# EAGLE design Sorter (EAGLE 9.5.1)
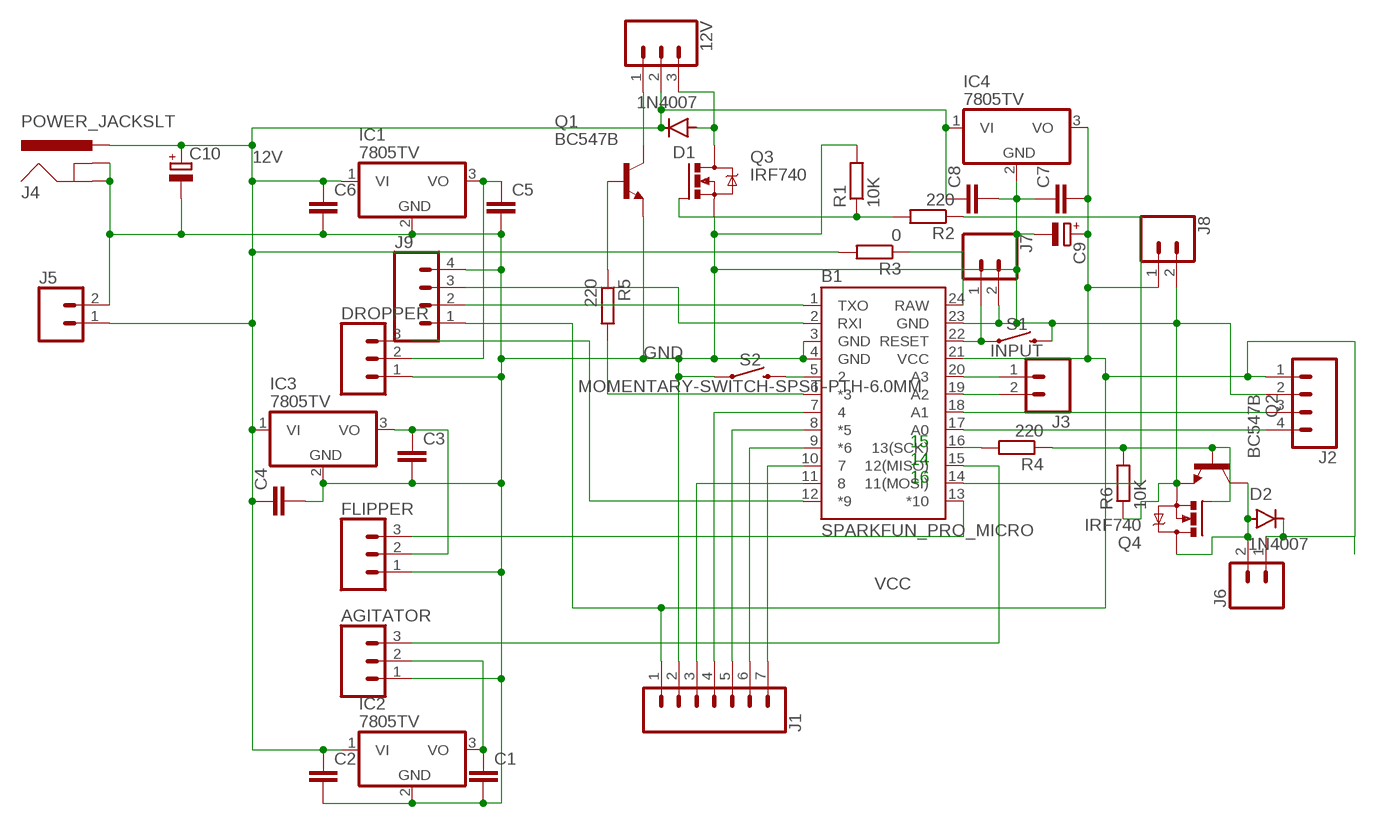
[diagram p0: schematic, sheet 1]

## Parts
12V  CONN_03LONGPADS  [1X03_LONGPADS]
AGITATOR  CONN_03LONGPADS  [1X03_LONGPADS]
B1  SPARKFUN_PRO_MICRO  [SPARKFUN_PRO_MICRO]
C1  C2.5/2  [C2.5-2]
C2  C2.5/2  [C2.5-2]
C3  C2.5/2  [C2.5-2]
C4  C2.5/2  [C2.5-2]
C5  C2.5/2  [C2.5-2]
C6  C2.5/2  [C2.5-2]
C7  C2.5/2  [C2.5-2]
C8  C2.5/2  [C2.5-2]
C9  CPOL-EUE2.5-5  [E2,5-5]
C10  CPOL-EUE2.5-5  [E2,5-5]
D1  1N4007  [DO-41]
D2  1N4007  [DO-41]
DROPPER  CONN_03LONGPADS  [1X03_LONGPADS]
FLIPPER  CONN_03LONGPADS  [1X03_LONGPADS]
IC1  7805TV  [TO220V]
IC2  7805TV  [TO220V]
IC3  7805TV  [TO220V]
IC4  7805TV  [TO220V]
J1  CONN_07LONGPADS  [1X07_LONGPADS]
J2  CONN_04LONGPADS  [1X04_LONGPADS]
J3  CONN_02  [1X02]
J4  POWER_JACKSLT  [POWER_JACK_SLOT]
J5  CONN_023.5MM  [SCREWTERMINAL-3.5MM-2]
J6  CONN_02PTH3  [1X02_LONGPADS]
J7  CONN_02PTH3  [1X02_LONGPADS]
J8  CONN_02  [1X02]
J9  CONN_04  [1X04]
Q1  BC547B  [TO92]
Q2  BC547B  [TO92]
Q3  IRF740  [TO220BV]
Q4  IRF740  [TO220BV]
R1  10K  R-EU_0204/7  [0204/7]
R2  220  R-EU_0204/7  [0204/7]
R3  0  R-EU_0204/7  [0204/7]
R4  220  R-EU_0204/7  [0204/7]
R5  220  R-EU_0204/7  [0204/7]
R6  10K  R-EU_0204/7  [0204/7]
S1  INPUT  MOMENTARY-SWITCH-SPST-PTH-6.0MM  [TACTILE_SWITCH_PTH_6.0MM]
S2  MOMENTARY-SWITCH-SPST-PTH-6.0MM  [TACTILE_SWITCH_PTH_6.0MM]

## Nets
12V: 12V.2 C2.1 C4.1 C6.1 C8.1 C10.+ D1.C IC1.1(VI) IC2.1(VI) IC3.1(VI) IC4.1(VI) J4.PWR J5.1 R3.2
GND: AGITATOR.1 B1.3(GND) B1.4(GND) B1.23(GND) C1.2 C2.2 C3.2 C4.2 C5.2 C6.2 C7.1 C8.2 C9.- C10.- DROPPER.1 FLIPPER.1 IC1.2(GND) IC2.2(GND) IC3.2(GND) IC4.2(GND) J1.2 J2.2 J4.GND@1(GNDBREAK) J4.GND@2(GND) J5.2 J7.2 J8.2 J9.4 Q1.1(E) Q2.1(E) Q3.S Q4.S R1.2 R6.1 S1.3 S2.1
N$1: AGITATOR.2 C1.1 IC2.3(VO)
N$2: C5.1 DROPPER.2 IC1.3(VO)
N$3: C3.1 FLIPPER.2 IC3.3(VO)
N$4: B1.12(*9) DROPPER.3
N$5: B1.13(*10) FLIPPER.3
N$6: AGITATOR.3 B1.15(12(MISO))
N$7: 12V.1 Q1.3(C)
N$8: B1.6(*3) R5.2
N$9: B1.14(11(MOSI)) R2.1
N$10: 12V.3 D1.A Q3.D
N$11: Q3.G R1.1 R2.2
N$12: B1.10 J1.7
N$13: B1.9(*6) J1.6
N$14: B1.8(*5) J1.5
N$15: B1.7 J1.4
N$16: B1.11 J1.3
N$17: B1.2(RXI) J9.3
N$18: B1.24(RAW) R3.1
N$19: B1.19(A2) J3.2
N$20: B1.22(RESET) J7.1 S1.1
N$21: B1.5 S2.3
N$22: B1.1(TXO) J9.2
N$23: B1.18(A1) J2.3
N$24: B1.17(A0) J2.4
N$25: B1.16(13(SCK)) R4.2
N$26: Q2.2(B) Q4.G R4.1 R6.2
N$27: Q1.2(B) R5.1
N$28: D2.A J6.2 Q2.3(C) Q4.D
N$29: B1.20(A3) J3.1
VCC: B1.21(VCC) C7.2 C9.+ D2.C IC4.3(VO) J1.1 J2.1 J6.1 J8.1 J9.1

## Notes on the sheet
- 15
- 14
- 16

## Library data of the parts
12V AGITATOR DROPPER FLIPPER = SparkFun-Connectors:CONN_03: Multi connection point. Often used as Generic Header-pin footprint for 0.1 inch spaced/style header connections On any of the 0.1 inch spaced packages, you can populate with these: Break Away Headers - Straight <https://www.sparkfun.com/products/116> (PRT-00116) Break Away Male Headers - Right Angle <https://www.sparkfun.com/products/553> (PRT-00553) Female Headers <https://www.sparkfun.com/products/115> (PRT-00115) Break Away Headers - Machine Pin <https://www.sparkfun.com/products/117> (PRT-00117) Break Away Female Headers - Swiss Machine Pin <https://www.sparkfun.com/products/743> (PRT-00743) Stackable Header - 3 Pin (Female, 0.1") <https://www.sparkfun.com/products/13875> (PRT-13875) For SCREWTERMINALS and SPRING TERMINALS visit here: Screw Terimnals on SparkFun.com <https://www.sparkfun.com/search/results?term=Screw+Terminals> (5mm/3.5mm/2.54mm spacing) This device is also useful as a general connection point to wire up your design to another part of your project. Our various solder wires solder well into these plated through hole pads. Hook-Up Wire - Assortment (Stranded, 22 AWG) <https://www.sparkfun.com/products/11375> (PRT-11375) Hook-Up Wire - Assortment (Solid Core, 22 AWG) <https://www.sparkfun.com/products/11367> (PRT-11367) View the entire wire category on our website here <https://www.sparkfun.com/categories/141> Special notes: Molex polarized connector foot print use with SKU : PRT-08232 with associated crimp pins and housings.
B1 = SparkFun-Boards:SPARKFUN_PRO_MICRO: SparkFun Pro Micro Atmega32U4 compatible footprint. SparkFun Products: 3.3V/8MHz <https://www.sparkfun.com/products/12587> 5V/16MHz <https://www.sparkfun.com/products/12640>
C1-C8 = capacitor-wima:C: CAPACITOR naming: grid - package width
C9 C10 = rcl:CPOL-EU: POLARIZED CAPACITOR, European symbol; SPICEPREFIX: C
D1 D2 = Diodes:1N4007: DIODE GEN PURP 1KV 1A DO41 Manufacturer's datasheet <https://www.mccsemi.com/pdf/Products/1N4001-1N4007(DO-41).pdf>; CREATED_BY: PCBLayout.com; DIGIKEY_PART_NUMBER: 1N4007MSCT-ND; MANUFACTURER: Micro Commercial Co; MPN: 1N4007; PACKAGE: DO-41
IC1-IC4 = linear:78*: Positive VOLTAGE REGULATOR Source: http://cache.national.com/ds/LM/LM78L05.pdf http://www.fairchildsemi.com/ds/LM/LM7805.pdf
J1 = SparkFun-Connectors:CONN_07: Multi connection point. Often used as Generic Header-pin footprint for 0.1 inch spaced/style header connections On any of the 0.1 inch spaced packages, you can populate with these: Break Away Headers - Straight <https://www.sparkfun.com/products/116> (PRT-00116) Break Away Male Headers - Right Angle <https://www.sparkfun.com/products/553> (PRT-00553) Female Headers <https://www.sparkfun.com/products/115> (PRT-00115) Break Away Headers - Machine Pin <https://www.sparkfun.com/products/117> (PRT-00117) Break Away Female Headers - Swiss Machine Pin <https://www.sparkfun.com/products/743> (PRT-00743) For SCREWTERMINALS and SPRING TERMINALS visit here: Screw Terimnals on SparkFun.com <https://www.sparkfun.com/search/results?term=Screw+Terminals> (5mm/3.5mm/2.54mm spacing) This device is also useful as a general connection point to wire up your design to another part of your project. Our various solder wires solder well into these plated through hole pads. Hook-Up Wire - Assortment (Stranded, 22 AWG) <https://www.sparkfun.com/products/11375> (PRT-11375) Hook-Up Wire - Assortment (Solid Core, 22 AWG) <https://www.sparkfun.com/products/11367> (PRT-11367) View the entire wire category on our website here <https://www.sparkfun.com/categories/141> Special notes: Molex polarized connector foot print use with SKU : PRT-08231 with associated crimp pins and housings. 1MM SMD Version SKU: PRT-10208 NOTES ON THE VARIANTS LOCK and LOCK_LONGPADS... This footprint was designed to help hold the alignment of a through-hole component (i.e. 6-pin header) while soldering it into place. You may notice that each hole has been shifted either up or down by 0.005 of an inch from it's more standard position (which is a perfectly straight line). This slight alteration caused the pins (the squares in the middle) to touch the edges of the holes. Because they are alternating, it causes a "brace" to hold the component in place. 0.005 has proven to be the perfect amount of "off-center" position when using our standard breakaway headers. Although looks a little odd when you look at the bare footprint, once you have a header in there, the alteration is very hard to notice. Also,if you push a header all the way into place, it is covered up entirely on the bottom side.
J2 J9 = SparkFun-Connectors:CONN_04: Multi connection point. Often used as Generic Header-pin footprint for 0.1 inch spaced/style header connections On any of the 0.1 inch spaced packages, you can populate with these: Break Away Headers - Straight <https://www.sparkfun.com/products/116> (PRT-00116) Break Away Male Headers - Right Angle <https://www.sparkfun.com/products/553> (PRT-00553) Female Headers <https://www.sparkfun.com/products/115> (PRT-00115) Break Away Headers - Machine Pin <https://www.sparkfun.com/products/117> (PRT-00117) Break Away Female Headers - Swiss Machine Pin <https://www.sparkfun.com/products/743> (PRT-00743) For SCREWTERMINALS and SPRING TERMINALS visit here: Screw Terimnals on SparkFun.com <https://www.sparkfun.com/search/results?term=Screw+Terminals> (5mm/3.5mm/2.54mm spacing) This device is also useful as a general connection point to wire up your design to another part of your project. Our various solder wires solder well into these plated through hole pads. Hook-Up Wire - Assortment (Stranded, 22 AWG) <https://www.sparkfun.com/products/11375> (PRT-11375) Hook-Up Wire - Assortment (Solid Core, 22 AWG) <https://www.sparkfun.com/products/11367> (PRT-11367) View the entire wire category on our website here <https://www.sparkfun.com/categories/141> Special notes: Molex polarized connector foot print use with SKU : PRT-08231 with associated crimp pins and housings. 1MM SMD Version SKU: PRT-10208; PROD_ID: CONN-09696
J3 J6-J8 = SparkFun-Connectors:CONN_02: Multi connection point. Often used as Generic Header-pin footprint for 0.1 inch spaced/style header connections On any of the 0.1 inch spaced packages, you can populate with these: Break Away Headers - Straight <https://www.sparkfun.com/products/116> (PRT-00116) Break Away Male Headers - Right Angle <https://www.sparkfun.com/products/553> (PRT-00553) Female Headers <https://www.sparkfun.com/products/115> (PRT-00115) Break Away Headers - Machine Pin <https://www.sparkfun.com/products/117> (PRT-00117) Break Away Female Headers - Swiss Machine Pin <https://www.sparkfun.com/products/743> (PRT-00743) For SCREWTERMINALS and SPRING TERMINALS visit here: Screw Terimnals on SparkFun.com <https://www.sparkfun.com/search/results?term=Screw+Terminals> (5mm/3.5mm/2.54mm spacing) This device is also useful as a general connection point to wire up your design to another part of your project. Our various solder wires solder well into these plated through hole pads. Hook-Up Wire - Assortment (Stranded, 22 AWG) <https://www.sparkfun.com/products/11375> (PRT-11375) Hook-Up Wire - Assortment (Solid Core, 22 AWG) <https://www.sparkfun.com/products/11367> (PRT-11367) View the entire wire category on our website here <https://www.sparkfun.com/categories/141> Special notes: Molex polarized connector foot print use with: PRT-08233 with associated crimp pins and housings. 2.54_SCREWTERM for use with PRT-10571. 3.5mm Screw Terminal footprints for PRT-08084 5mm Screw Terminal footprints for use with PRT-08432
J4 = SparkFun-Connectors:POWER_JACK: Power Jack Connector This is the standard 5.5mm barrel jack for power. The PTH is the most common, proven, reliable, footprint. The Slot footprint only works if the mill layer is transmitted to the PCB fab house so be warned. Here are the connectors we sell at SparkFun: DC Barrel Power Jack/Connector <https://www.sparkfun.com/products/119> (PRT-00119) DC Barrel Power Jack/Connector (SMD) <https://www.sparkfun.com/products/12748> (PRT-12748) DC Barrel Jack Adapter - Breadboard Compatible <https://www.sparkfun.com/products/10811> (PRT-10811) It is used on this SparkFun product (and many, many others): SparkFun RedBoard - Programmed with Arduino <https://www.sparkfun.com/products/12757> (DEV-12757) Also, if you need a mating power supply or connector, please check these out: Wall Adapter Power Supply - 9VDC 650mA <https://www.sparkfun.com/products/298> (TOL-00298) DC Barrel Jack Adapter - Male <https://www.sparkfun.com/products/10287> (PRT-10287); PROD_ID: PRT-00119
J5 = SparkFun-Connectors:CONN_02: Multi connection point. Often used as Generic Header-pin footprint for 0.1 inch spaced/style header connections On any of the 0.1 inch spaced packages, you can populate with these: Break Away Headers - Straight <https://www.sparkfun.com/products/116> (PRT-00116) Break Away Male Headers - Right Angle <https://www.sparkfun.com/products/553> (PRT-00553) Female Headers <https://www.sparkfun.com/products/115> (PRT-00115) Break Away Headers - Machine Pin <https://www.sparkfun.com/products/117> (PRT-00117) Break Away Female Headers - Swiss Machine Pin <https://www.sparkfun.com/products/743> (PRT-00743) For SCREWTERMINALS and SPRING TERMINALS visit here: Screw Terimnals on SparkFun.com <https://www.sparkfun.com/search/results?term=Screw+Terminals> (5mm/3.5mm/2.54mm spacing) This device is also useful as a general connection point to wire up your design to another part of your project. Our various solder wires solder well into these plated through hole pads. Hook-Up Wire - Assortment (Stranded, 22 AWG) <https://www.sparkfun.com/products/11375> (PRT-11375) Hook-Up Wire - Assortment (Solid Core, 22 AWG) <https://www.sparkfun.com/products/11367> (PRT-11367) View the entire wire category on our website here <https://www.sparkfun.com/categories/141> Special notes: Molex polarized connector foot print use with: PRT-08233 with associated crimp pins and housings. 2.54_SCREWTERM for use with PRT-10571. 3.5mm Screw Terminal footprints for PRT-08084 5mm Screw Terminal footprints for use with PRT-08432; PROD_ID: CONN-08399
Q1 Q2 = transistor-npn:BC547*: NPN Transistor
Q3 Q4 = transistor-power:IRF740: N-CHANNEL MOS FET
R1-R6 = rcl:R-EU_: RESISTOR, European symbol; SPICEPREFIX: R
S1 S2 = SparkFun-Switches:MOMENTARY-SWITCH-SPST: Momentary Switch (Pushbutton) - SPST Normally-open (NO) SPST momentary switches (buttons, pushbuttons). Variants PTH-12MM - 12mm square, through-hole Momentary Pushbutton Switch - 12mm Square <https://www.sparkfun.com/products/9190> (COM-09190) PTH-6.0MM, PTH-6.0MM-KIT - 6.0mm square, through-hole Mini Pushbutton Switch <https://www.sparkfun.com/products/97> (COM-00097) KIT package intended for soldering kit's - only one side of pads' copper is exposed. PTH-RIGHT-ANGLE-KIT - Right-angle, through-hole Right Angle Tactile Button <https://www.sparkfun.com/products/10791> - Used on SparkFun BigTime Watch Kit <https://www.sparkfun.com/products/11734> SMD-12MM - 12mm square, surface-mount Tactile Button - SMD (12mm) <https://www.sparkfun.com/products/12993> (COM-12993) Used on SparkFun PicoBoard <https://www.sparkfun.com/products/11888> SMD-4.5MM - 4.5mm Square Trackball Switch Used on SparkFun Blackberry Trackballer Breakout <https://www.sparkfun.com/products/13169> SMD-4.6MMX2.8MM - 4.60mm x 2.80mm, surface mount Used on SparkFun SAMD21 Mini Breakout <https://www.sparkfun.com/products/13664> SMD-5.2MM, SMD-5.2-REDUNDANT - 5.2mm square, surface-mount Mini Pushbutton Switch - SMD <https://www.sparkfun.com/products/8720> (COM-08720) Used on Arduino Pro Mini <https://www.sparkfun.com/products/11114> REDUNDANT package connects both switch circuits together SMD-6.0X3.5MM - 6.0 x 3.5mm, surface mount Momentary Reset Switch SMD <https://www.sparkfun.com/products/8229> (COM-08229) SMD-6.2MM-TALL - 6.2mm square, surface mount Tactile Button - SMD (6mm) <https://www.sparkfun.com/products/12992> Used on SparkFun Digital Sandbox <https://www.sparkfun.com/products/12651> SMD-RIGHT-ANGLE - Right-angle, surface mount Used on SparkFun Block for Intel® Edison - Arduino <https://www.sparkfun.com/products/13036>; PROD_ID: SWCH-08441; SF_SKU: COM-00097

## Board
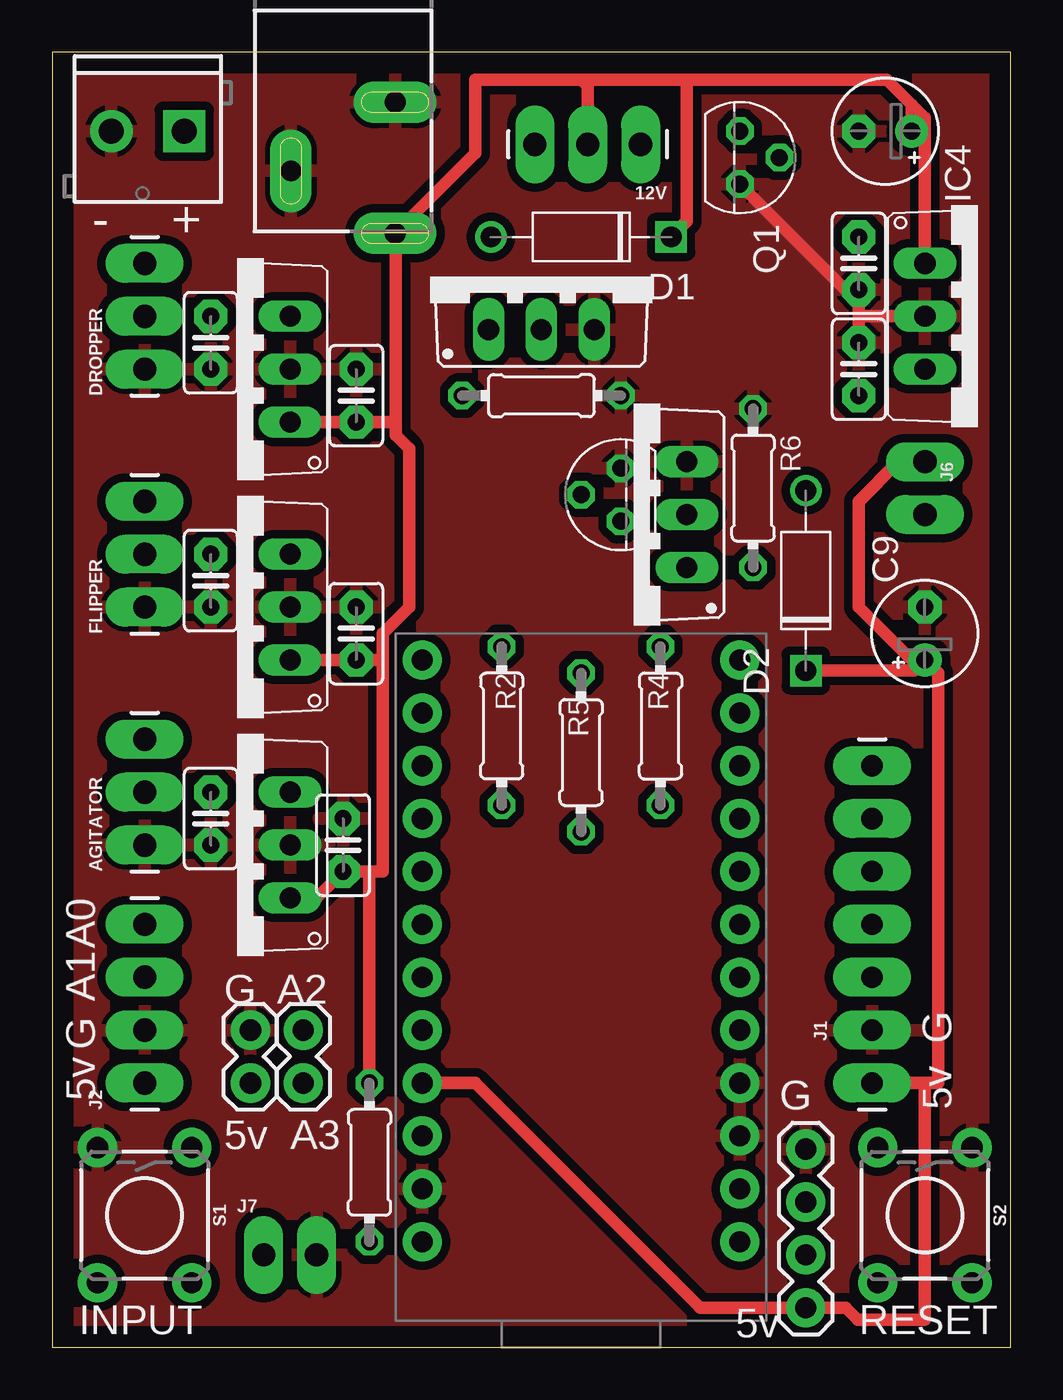
[diagram p1: board, top side]
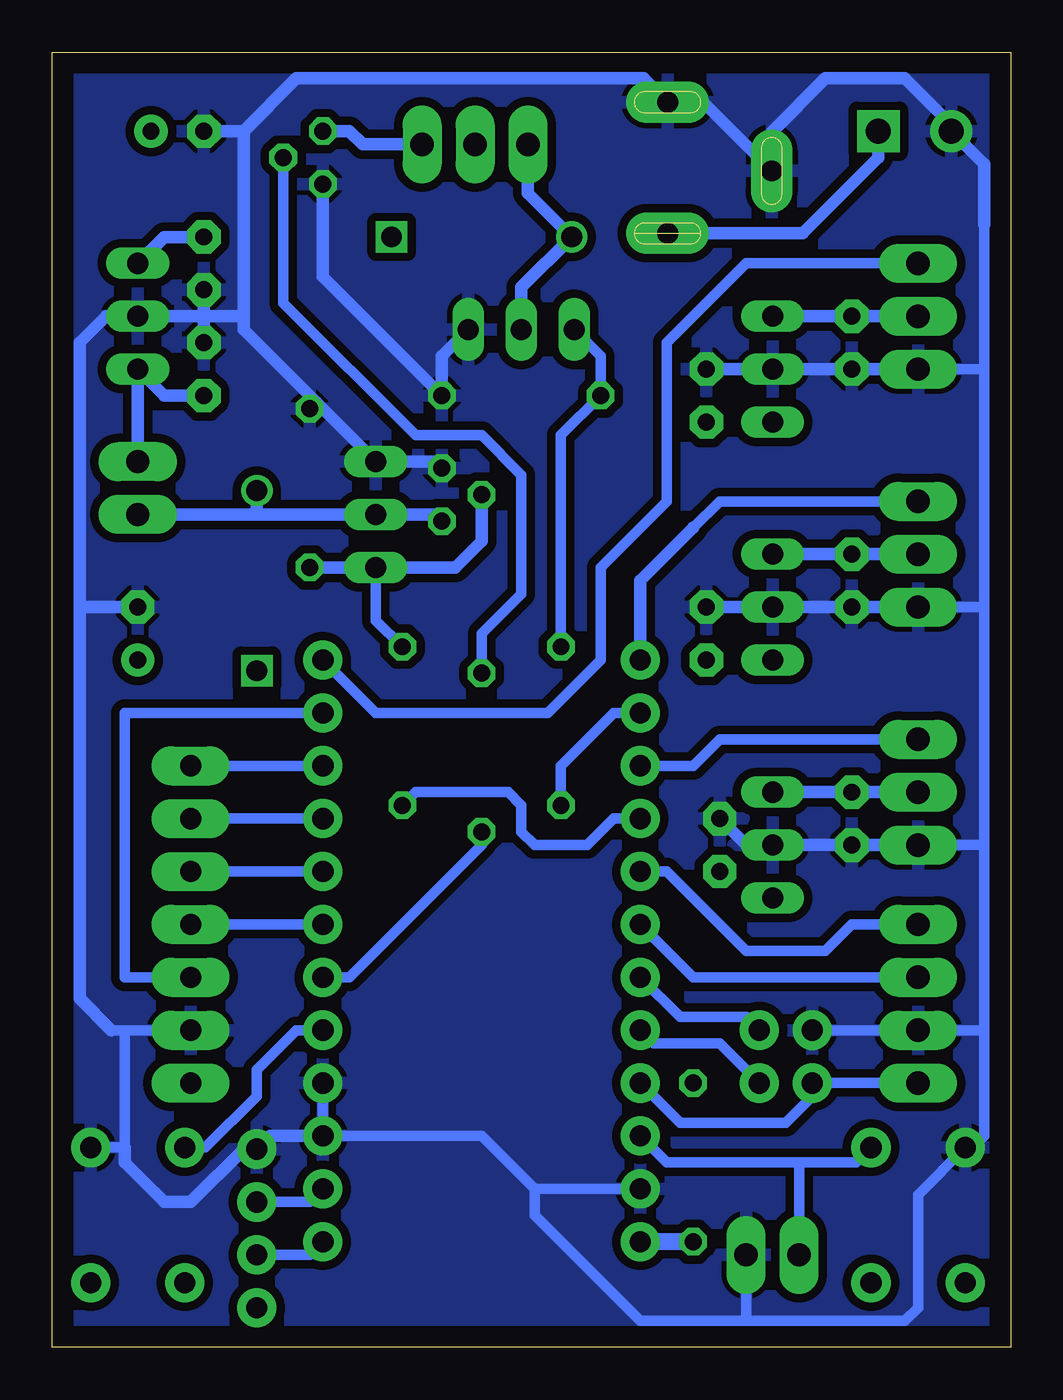
[diagram p2: board, bottom side, seen from below]

Size 46.02 x 62.22 mm. Coordinates in mm from the lower left corner, seen from the top.
Outline: 0,0 46.02,0 46.02,62.22 0,62.22 0,0
Copper layers (1*16): Top 0.035mm / dielectric 1.5mm / Bottom 0.035mm
Design rules "default": minimum track width 6mil, minimum drill 0.35mm, track to track 6mil, track to pad 6mil, pad to pad 6mil, via to via 6mil, smd to smd 6mil, copper to edge 40mil, drill to drill 6mil, minimum pad ring 10mil, minimum via ring 8mil, stop-mask expansion 4mil, vias tented up to drill 0mil, thermal gap 10mil

### Footprints (pad centres in the part's own frame; a part is rotated, then mirrored left to right if it is on the bottom)
1X03_LONGPADS = drill 1.118 pad 1.88 long: 1 0,0; 2 2.54,0; 3 5.08,0
SPARKFUN_PRO_MICRO = drill 1.016 pad 1.88: 1 -7.62,12.7; 2 -7.62,10.16; 3 -7.62,7.62; 4 -7.62,5.08; 5 -7.62,2.54; 6 -7.62,0; 7 -7.62,-2.54; 8 -7.62,-5.08; 9 -7.62,-7.62; 10 -7.62,-10.16; 11 -7.62,-12.7; 12 -7.62,-15.24; 13 7.62,-15.24; 14 7.62,-12.7; 15 7.62,-10.16; 16 7.62,-7.62; 17 7.62,-5.08; 18 7.62,-2.54; 19 7.62,0; 20 7.62,2.54; 21 7.62,5.08; 22 7.62,7.62; 23 7.62,10.16; 24 7.62,12.7
C2.5-2 = drill 0.813 pad 1.6 octagon: 1 -1.27,0; 2 1.27,0
E2,5-5 = drill 0.813 pad 1.6: + -1.27,0 | drill 0.813 pad 1.6 octagon: - 1.27,0
DO-41 = drill 1: A 4.325,0 | drill 1 square: C -4.325,0
TO220V = drill 1.016 long: 1 -2.54,-2.54; 2 0,-2.54; 3 2.54,-2.54
1X07_LONGPADS = drill 1.016 pad 1.88 long: 1 0,0; 2 2.54,0; 3 5.08,0; 4 7.62,0; 5 10.16,0; 6 12.7,0; 7 15.24,0
1X04_LONGPADS = drill 1.118 pad 1.88 long: 1 0,0; 2 2.54,0; 3 5.08,0; 4 7.62,0
1X02 = drill 1.016 pad 1.88: 1 0,0; 2 2.54,0
POWER_JACK_SLOT = drill 1 pad 2 long: GND@1 2.58,7.5; GND@2 7.58,10.8; PWR 2.58,13.8
SCREWTERMINAL-3.5MM-2 = drill 1.2 pad 2.032 square: 1 0,0 | drill 1.2 pad 2.032: 2 3.5,0
1X02_LONGPADS = drill 1.118 pad 1.88 long: 1 0,0; 2 2.54,0
1X04 = drill 1.016 pad 1.88: 1 0,0; 2 2.54,0; 3 5.08,0; 4 7.62,0
TO92 = drill 0.813 octagon: 1 1.27,0; 2 0,1.905; 3 -1.27,0
TO220BV = drill 1.016 long: D 0,-2.54; G -2.54,-2.54; S 2.54,-2.54
0204/7 = drill 0.813 octagon: 1 -3.81,0; 2 3.81,0
TACTILE_SWITCH_PTH_6.0MM = drill 1.016 pad 1.88: 1 -3.251,2.261; 2 3.251,2.261; 3 -3.251,-2.261; 4 3.251,-2.261

### Placement (x,y rotation side)
12V  28.26,57.78 180 top
AGITATOR  4.45,24.13 90 top
B1  25.4,17.78 180 top
C1  7.62,25.4 270 top
C2  13.97,24.13 90 top
C3  7.62,36.83 270 top
C4  14.61,34.29 90 top
C5  7.62,48.26 270 top
C6  14.61,45.72 90 top
C7  38.73,46.99 270 top
C8  38.73,52.07 270 top
C9  41.91,34.29 90 top
C10  40.01,58.42 180 top
D1  25.4,53.34 180 top
D2  36.2,36.83 90 top
DROPPER  4.45,46.99 90 top
FLIPPER  4.45,35.56 90 top
IC1  8.89,46.99 90 top
IC2  8.89,24.13 90 top
IC3  8.89,35.56 90 top
IC4  44.45,49.53 270 top
J1  39.37,12.7 90 top
J2  4.45,12.7 90 top
J3  12.06,12.7 90 top
J4  19.05,67.31 180 top
J5  6.35,58.42 180 top
J6  41.91,42.55 270 top
J7  10.16,4.45 0 top
J8  9.53,12.7 90 top
J9  36.2,1.91 90 top
Q1  33.02,57.15 270 top
Q2  27.3,40.96 90 top
Q3  23.5,51.44 0 top
Q4  27.94,40.01 90 top
R1  23.5,45.72 0 top
R2  21.59,29.84 90 top
R3  15.24,8.89 90 top
R4  29.21,29.84 270 top
R5  25.4,28.57 270 top
R6  33.66,41.27 270 top
S1  4.45,6.35 270 top
S2  41.91,6.35 270 top

### Tracks (layer width: path | path; a pad name or v marks a point on that pad's centre or on a via)
12V
  Top 0.61: R3.2 15.24,22.86 | 15.88,33.02 15.88,22.86 15.24,22.86 | 15.88,33.02 15.88,34.29 17.14,35.56 17.14,43.18 16.51,43.81 16.51,44.45 | 25.4,60.9 20.32,60.9 20.32,57.36 J4.PWR 16.51,53.47 16.51,44.45 | 25.4,60.9 25.72,60.58 12V.2 | D1.C 30.48,54.09 30.48,60.9 | 30.48,60.9 25.4,60.9 | IC2.1 12.7,21.59 C2.1 15.24,22.86 | 41.27,59.69 40.07,60.9 30.48,60.9 | 41.27,59.69 C10.+ 41.91,57.78 | 41.91,57.78 IC4.1 | 41.27,59.69 41.91,59.05 41.91,57.78 | IC3.1 C4.1 15.88,33.02 | 16.51,44.45 C6.1 IC1.1
  Bottom 0.61: C8.1 40.64,53.34 IC4.1 | J5.1 6.35,57.15 9.99,53.51 J4.PWR
GND
  Top 0.61: IC4.2 38.73,49.53 C7.1 C8.2 38.42,50.48 Q1.1
  Bottom 0.508: 1.27,15.24 J2.2 J8.2 | 1.27,15.24 1.27,10.16 1.83,9.6 S1.3 4.45,7.34 4.45,1.91 5.08,1.27 12.7,1.27 | 1.27,46.99 1.27,53.93 | 1.27,46.99 1.27,35.56 | 1.27,35.56 1.27,24.13 | 1.27,24.13 1.27,15.24 | DROPPER.1 1.27,46.99 | FLIPPER.1 1.27,35.56 | AGITATOR.1 1.27,24.13 | B1.23 22.86,7.62 | 22.86,7.62 25.4,10.16 B1.3 B1.4 | J1.2 42.55,15.24 | 42.55,15.24 43.18,15.24 | 42.55,15.24 42.55,9.6 S2.1 | 22.86,7.62 22.86,6.35 17.78,1.27 12.7,1.27 | J7.2 12.7,1.27
  Bottom 0.61: Q3.S 27.3,47.62 R1.2 33.02,51.44 Q1.1 | 1.27,53.93 1.27,56.84 J5.2 2.85,58.73 5.08,60.96 8.89,60.96 11.47,58.38 J4.GND@2 14.77,59.81 J4.GND@1 17.62,60.96 34.29,60.96 36.83,58.42 | 38.73,49.53 IC4.2 43.43,49.53 44.7,48.26 44.7,35.56 | C2.2 12.7,24.13 IC2.2 C1.2 AGITATOR.1 | C7.1 38.73,49.53 | 38.73,49.53 C8.2 | 36.83,49.53 36.83,58.42 | 38.73,49.53 36.83,49.53 | 36.83,58.42 C10.- | 43.18,15.24 44.7,16.76 44.7,35.56 | FLIPPER.1 C3.2 IC3.2 C4.2 | C6.2 IC1.2 C5.2 DROPPER.1 | B1.3 35.56,10.16 J9.4 36.83,9.53 39.37,6.99 40.64,6.99 42.55,8.89 42.55,9.6 | 36.83,49.53 36.83,48.9 33.34,45.4 | Q2.1 27.62,42.55 Q4.S 33.34,45.4 | C9.- 44.7,35.56 | R6.1 33.34,45.4
  pour Top (isolate 0.406): 0,62.23 46.35,62.23 46.35,0 0,0
  pour Bottom (isolate 0.406): 0,62.23 46.35,62.23 46.35,0 0,0
N$1
  Bottom 0.61: AGITATOR.2 C1.1 IC2.3
N$2
  Bottom 0.61: DROPPER.2 C5.1 IC1.3
N$3
  Bottom 0.61: FLIPPER.2 C3.1 IC3.3
N$4
  Bottom 0.508: DROPPER.3 12.7,52.07 16.51,48.26 16.51,40.64 19.68,37.47 19.68,33.02 22.23,30.48 30.48,30.48 B1.12
N$5
  Bottom 0.508: 15.24,39.37 13.97,40.64 FLIPPER.3
  Bottom 0.61: 15.24,39.37 17.78,36.83 B1.13
N$6
  Bottom 0.508: AGITATOR.3 13.97,29.21 15.24,27.94 B1.15
N$7
  Bottom 0.61: 12V.1 31.11,57.78 31.75,58.42 Q1.3
N$8
  Bottom 0.508: B1.6 31.75,17.78 25.4,24.13 R5.2
N$9
  Bottom 0.508: B1.14 19.05,30.48 21.59,27.94 R2.1
N$10
  Bottom 0.61: 12V.3 23.18,55.44 D1.A 23.5,50.92 Q3.D
N$11
  Bottom 0.508: R2.2 21.59,43.81 R1.1 19.68,47.62 Q3.G
N$12
  Bottom 0.508: B1.10 J1.7
N$13
  Bottom 0.508: J1.6 B1.9
N$14
  Bottom 0.508: B1.8 J1.5
N$15
  Bottom 0.508: J1.4 B1.7
N$16
  Bottom 0.508: B1.11 42.55,30.48 42.55,17.78 J1.3
N$17
  Bottom 0.508: B1.2 33.66,6.99 J9.3
N$18
  Bottom 0.813: R3.1 B1.24
N$19
  Bottom 0.508: B1.19 15.88,15.88 12.7,15.88 J3.2
N$20
  Bottom 0.508: S1.1 7.42,8.89 10.16,8.89 | B1.22 16.51,8.89 10.16,8.89 | J7.1 10.16,8.89
N$21
  Bottom 0.508: B1.5 34.29,15.24 36.2,13.34 36.2,12.06 38.66,9.6 S2.3
N$22
  Bottom 0.508: B1.1 33.66,4.45 J9.2
N$23
  Bottom 0.508: B1.18 15.24,17.78 J2.3
N$24
  Bottom 0.508: J2.4 7.62,20.32 8.89,19.05 12.7,19.05 16.51,22.86 B1.17
N$25
  Bottom 0.508: B1.16 19.05,25.4 20.32,24.13 22.86,24.13 23.5,24.77 23.5,26.04 24.13,26.67 28.57,26.67 R4.2
N$26
  Bottom 0.508: Q4.G 30.48,34.92 R4.1
  Bottom 0.61: Q2.2 25.4,38.73 26.67,37.47 Q4.G R6.2
N$27
  Bottom 0.508: Q1.2 34.92,50.16 28.57,43.81 25.4,43.81 23.5,41.91 23.5,36.2 25.4,34.29 R5.1
N$28
  Bottom 0.61: Q2.3 27.62,40.01 Q4.D 36.2,40.01 | 36.2,40.01 J6.2 | D2.A 36.2,40.01
N$29
  Bottom 0.508: J3.1 13.97,14.61 17.14,14.61 B1.20
VCC
  Top 0.61: B1.21 20.32,12.7 31.11,1.91 J9.1 38.1,1.91 38.68,1.32 41.91,1.32 41.91,12.7 | J6.1 40.64,42.55 38.73,40.64 38.73,35.56 41.59,32.7 | 41.91,12.7 42.55,12.7 42.55,32.38 C9.+ 41.59,32.7 | 41.91,12.7 J1.1 | D2.C 41.4,32.51 41.59,32.7
  Bottom 0.508: B1.21 15.88,10.79 10.79,10.79 9.53,12.06 J8.1 J2.1
  Bottom 0.61: J6.1 IC4.3 40.64,45.72 C7.2

### Text on the board
tNames: - | + | A0 | A1 | G | A2 | G | G | 5v | G | 5v | 5v | A3 | 5v | INPUT | RESET